# EAGLE schematic RGBLineSensor_Sensor (EAGLE 9.4.2)
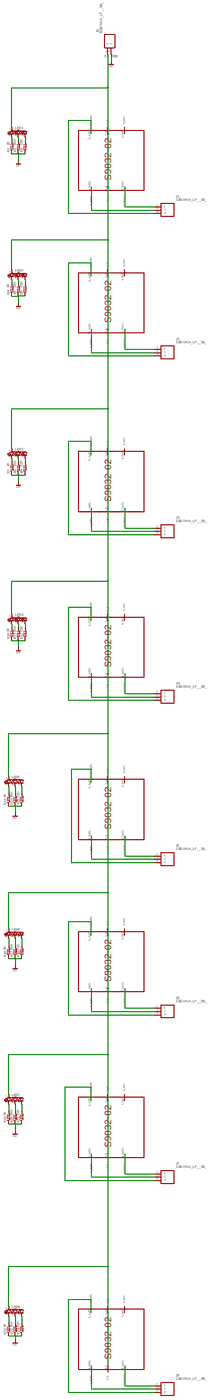
[diagram p0: schematic, sheet 1, overview]
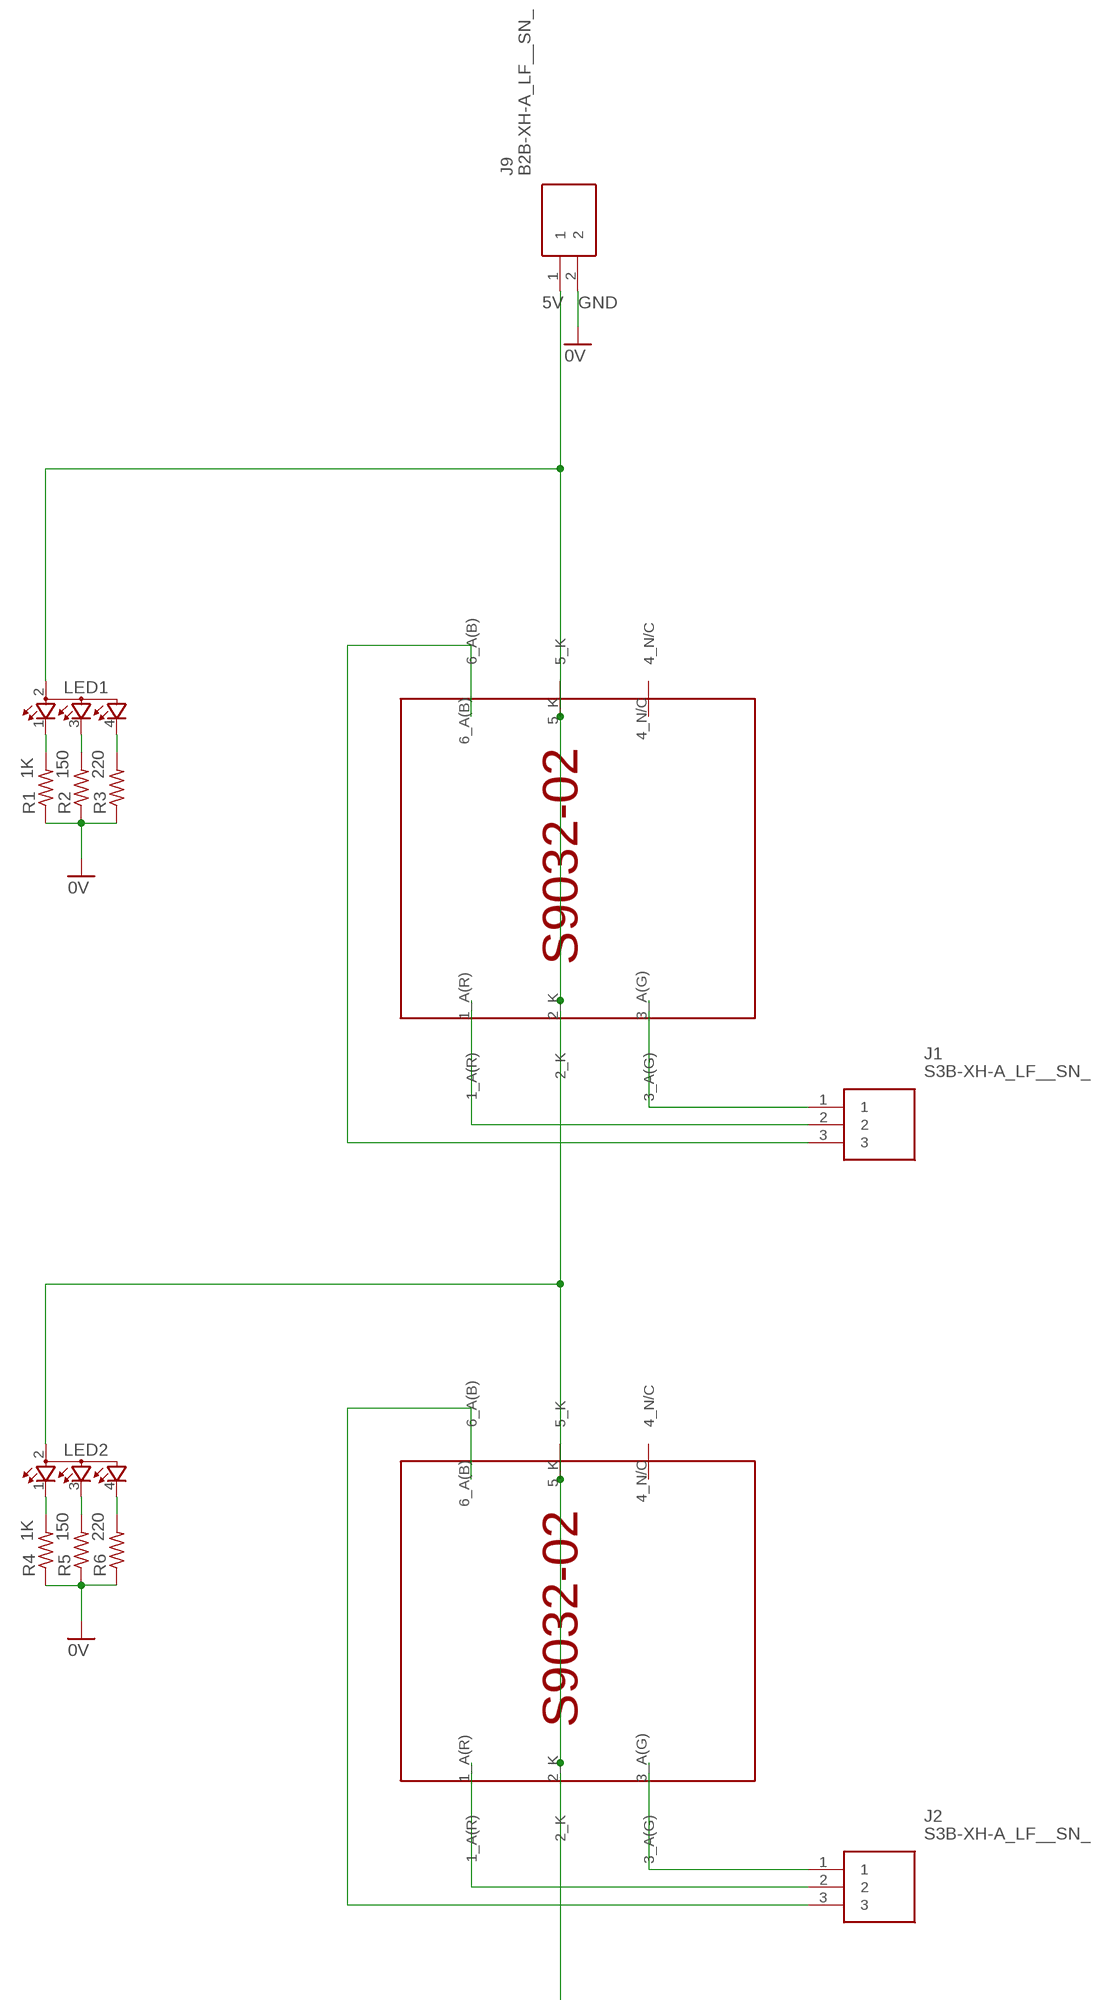
[diagram p1: schematic, sheet 1, part 1 of 4]
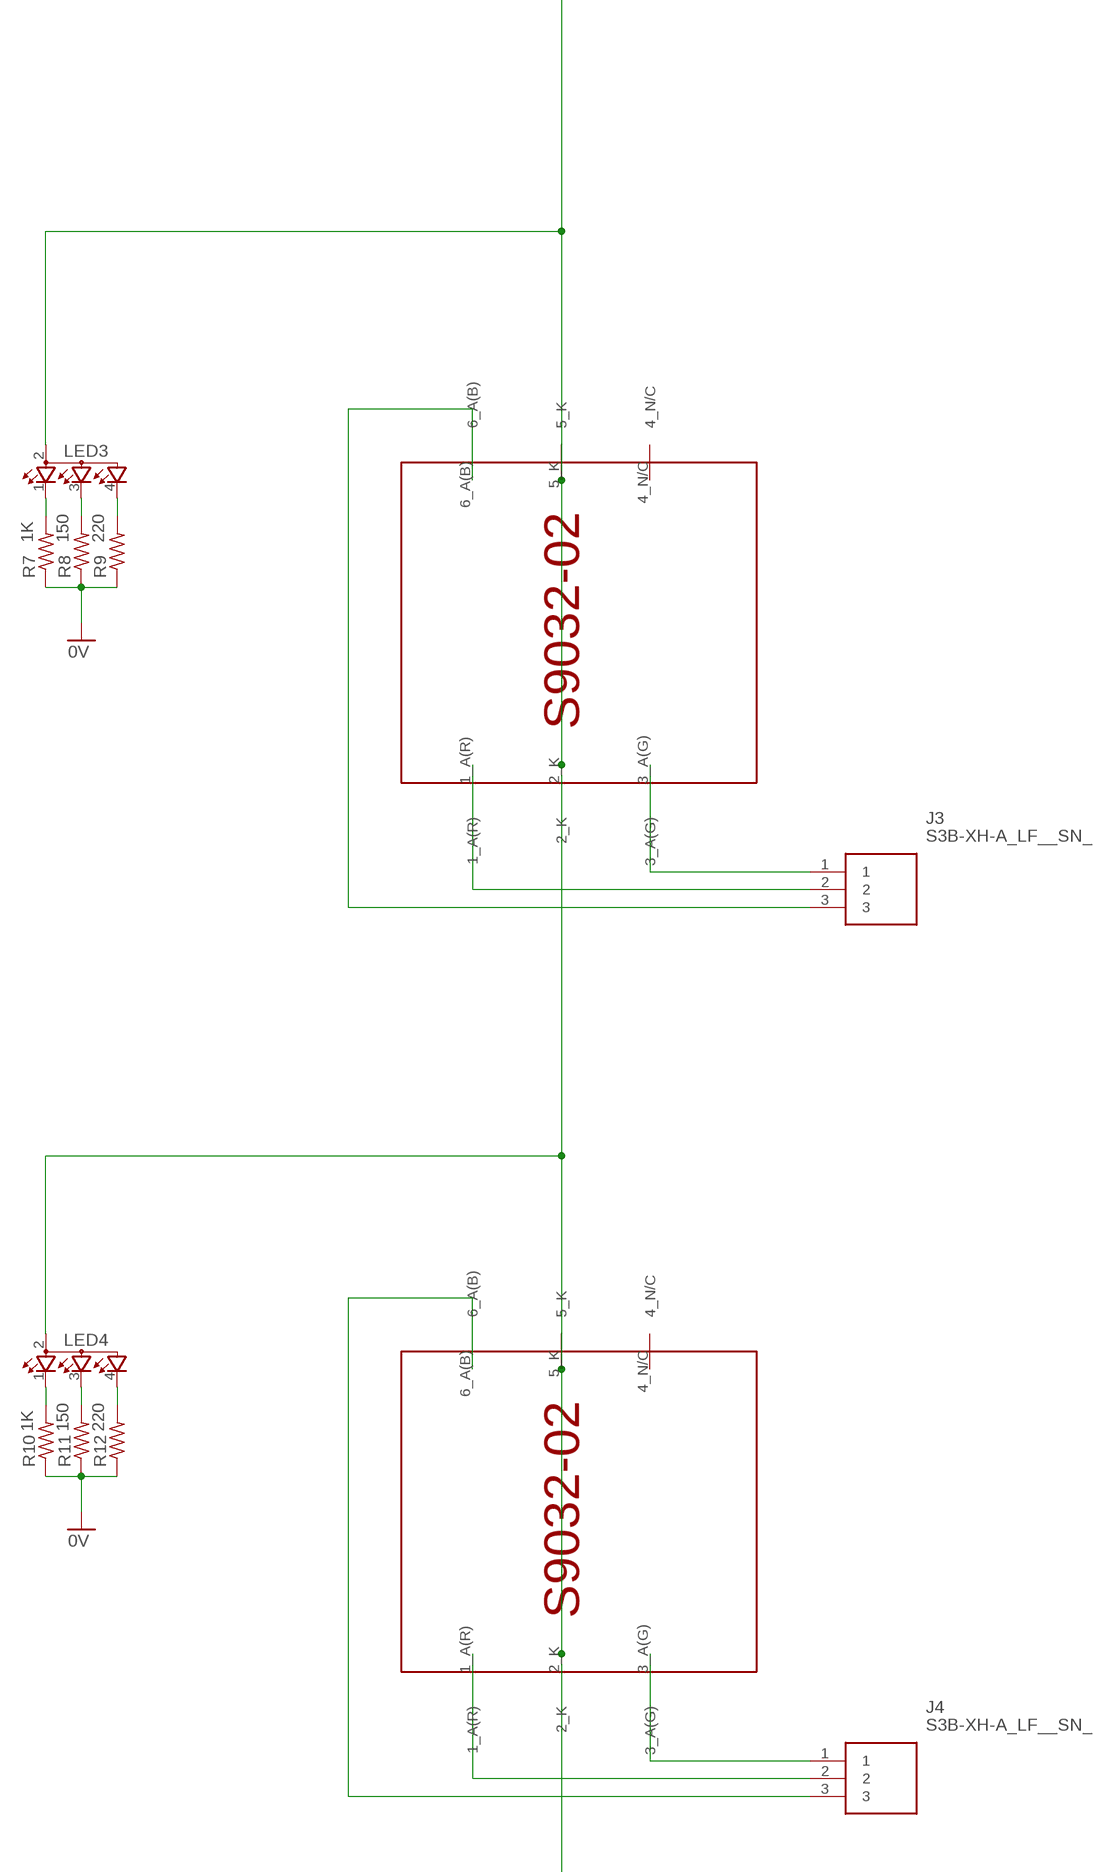
[diagram p2: schematic, sheet 1, part 2 of 4]
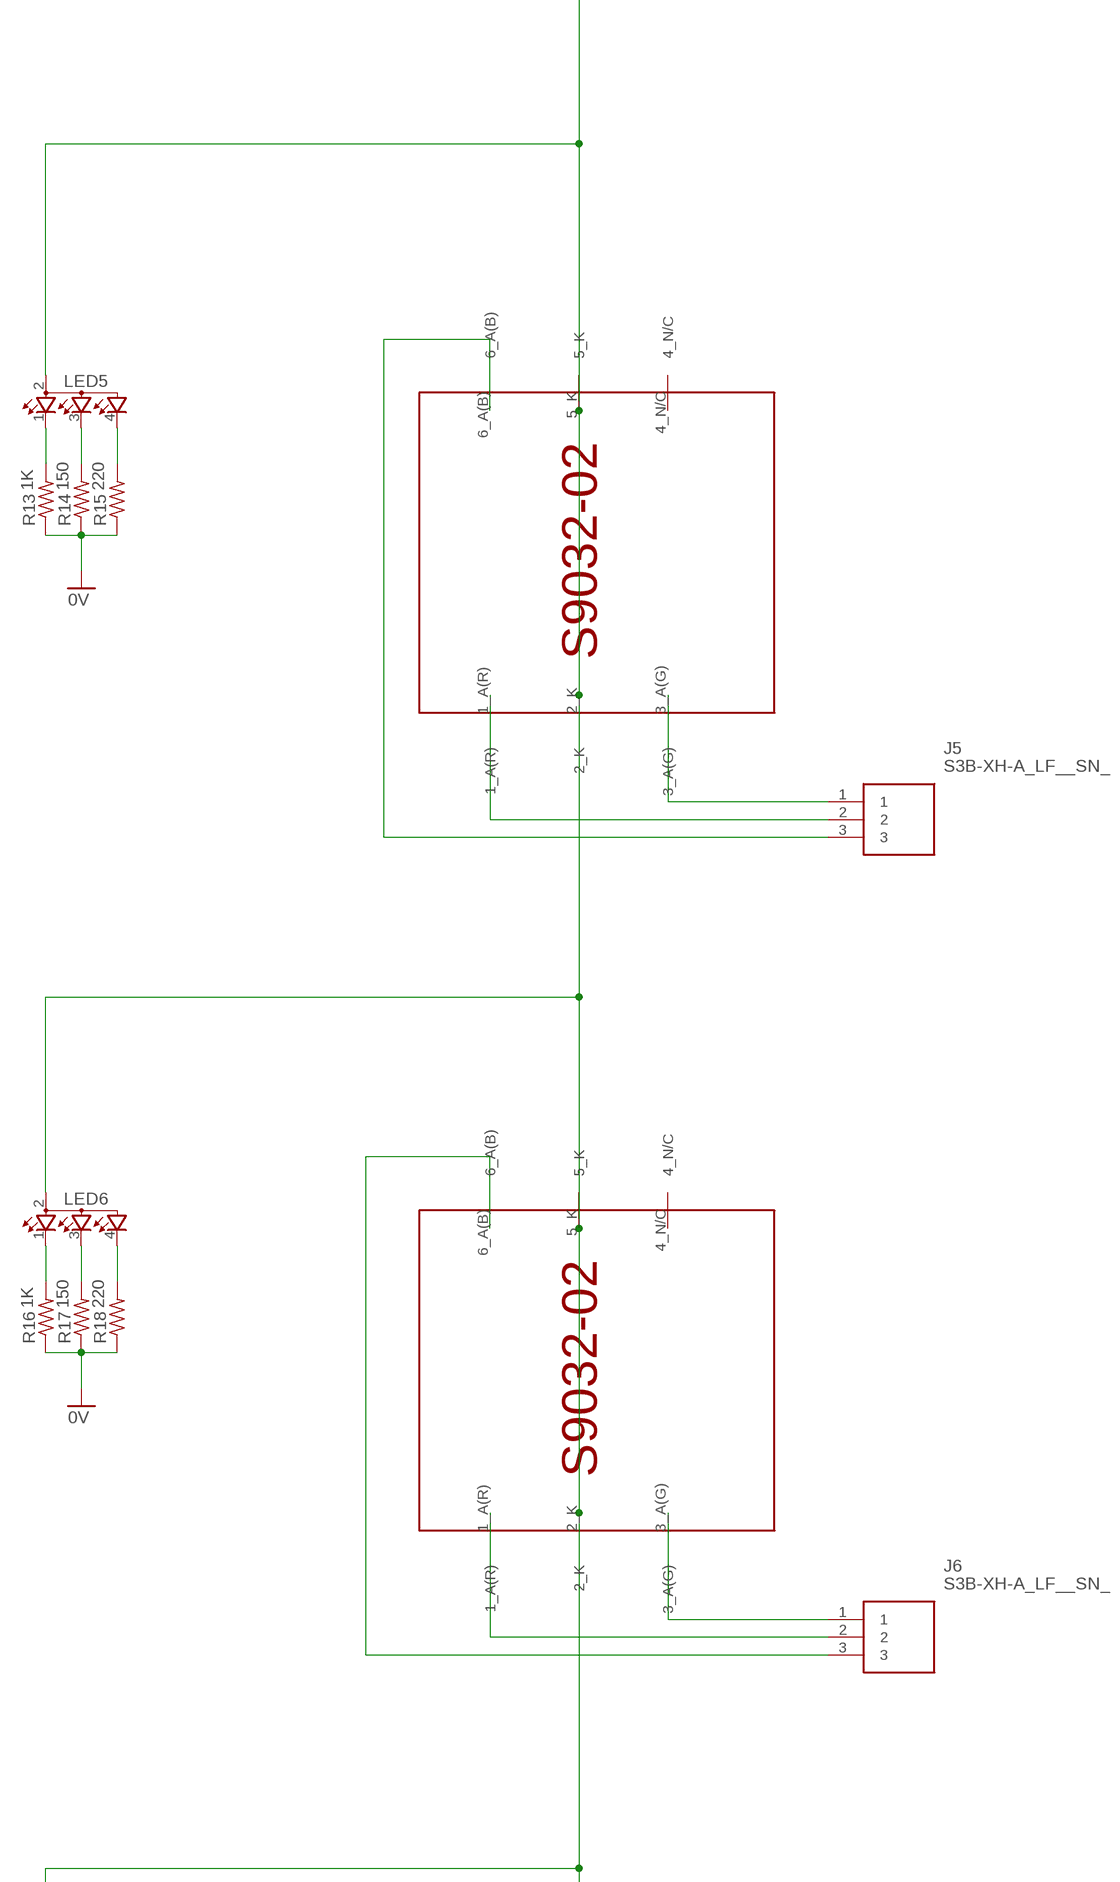
[diagram p3: schematic, sheet 1, part 3 of 4]
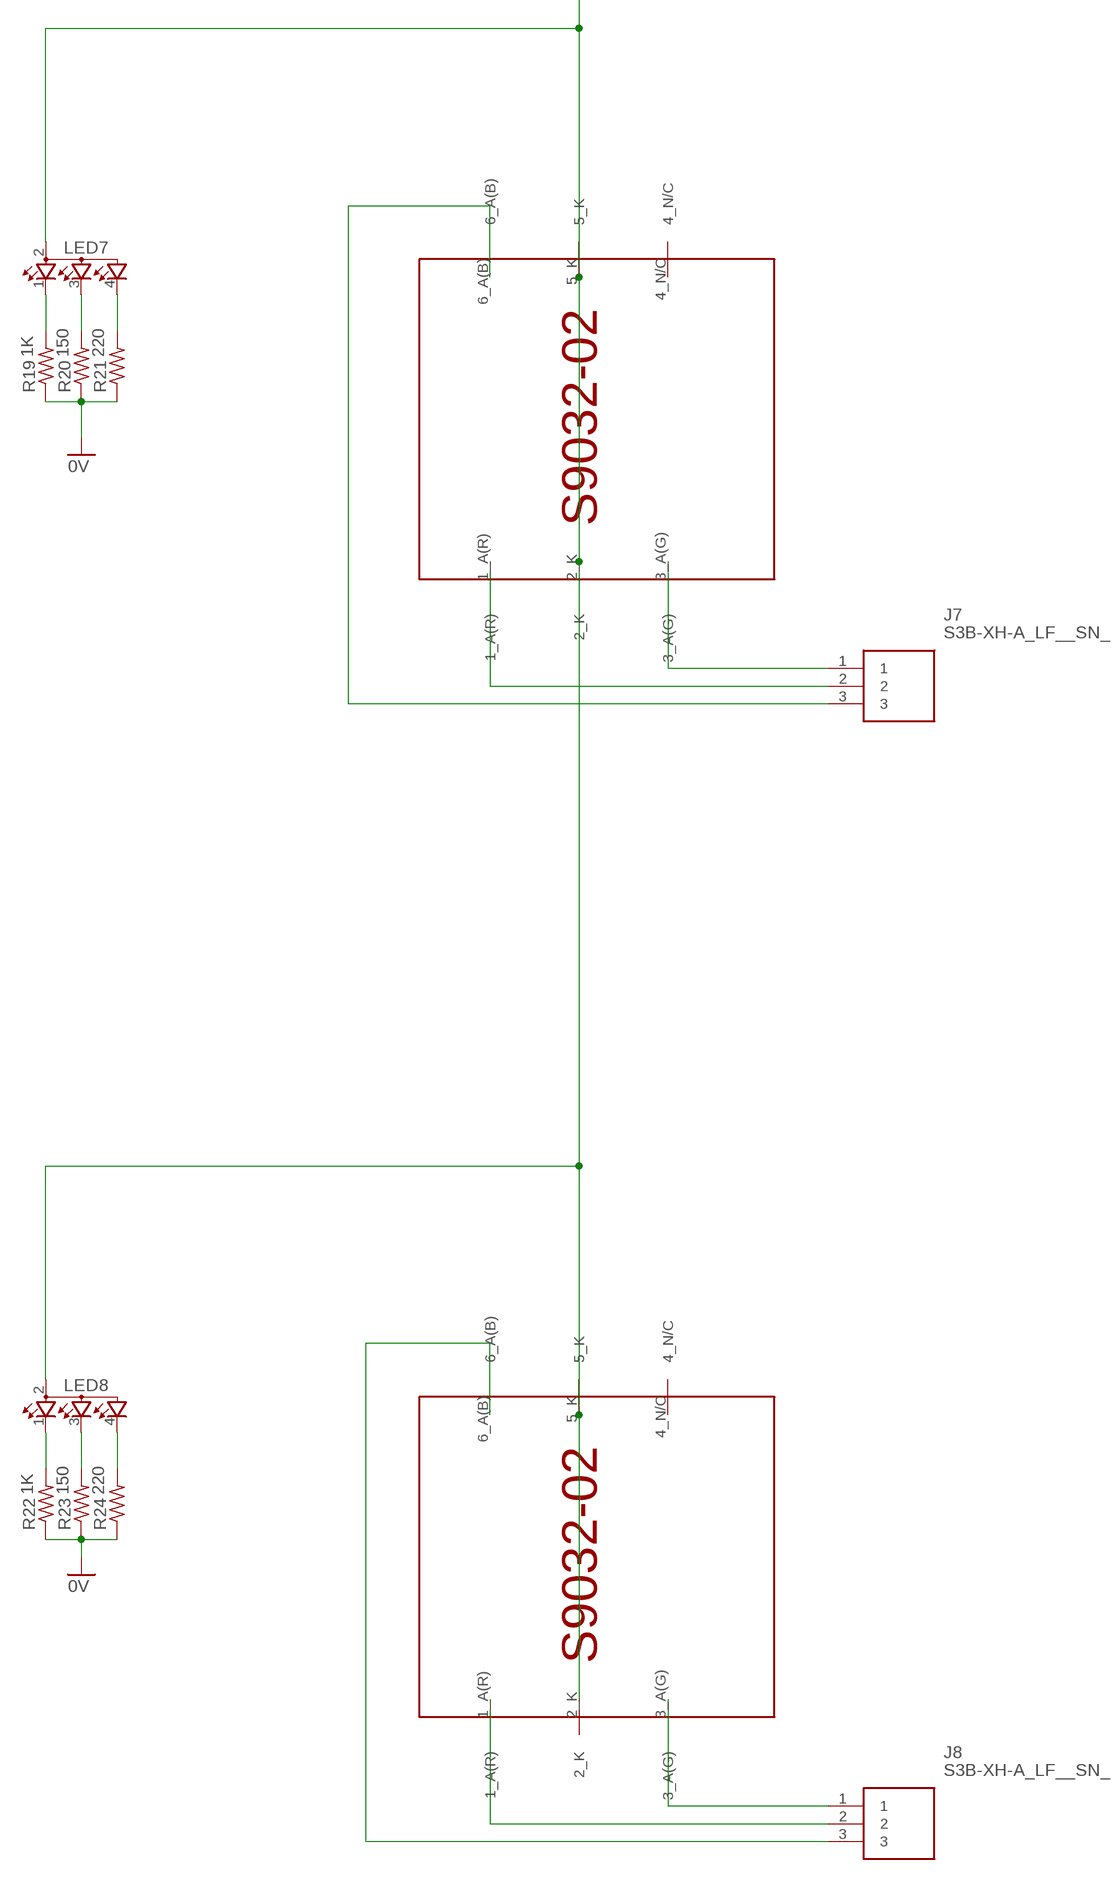
[diagram p4: schematic, sheet 1, part 4 of 4]

## Parts
J1  S3B-XH-A_LF__SN_  [SHDRRA3W80P0X250_1X3_990X1150X]
J2  S3B-XH-A_LF__SN_  [SHDRRA3W80P0X250_1X3_990X1150X]
J3  S3B-XH-A_LF__SN_  [SHDRRA3W80P0X250_1X3_990X1150X]
J4  S3B-XH-A_LF__SN_  [SHDRRA3W80P0X250_1X3_990X1150X]
J5  S3B-XH-A_LF__SN_  [SHDRRA3W80P0X250_1X3_990X1150X]
J6  S3B-XH-A_LF__SN_  [SHDRRA3W80P0X250_1X3_990X1150X]
J7  S3B-XH-A_LF__SN_  [SHDRRA3W80P0X250_1X3_990X1150X]
J8  S3B-XH-A_LF__SN_  [SHDRRA3W80P0X250_1X3_990X1150X]
J9  B2B-XH-A_LF__SN_  [SHDR2W64P0X250_1X2_740X575X700]
LED1  TOPLED-3  [P-LCC-4-3]
LED2  TOPLED-3  [P-LCC-4-3]
LED3  TOPLED-3  [P-LCC-4-3]
LED4  TOPLED-3  [P-LCC-4-3]
LED5  TOPLED-3  [P-LCC-4-3]
LED6  TOPLED-3  [P-LCC-4-3]
LED7  TOPLED-3  [P-LCC-4-3]
LED8  TOPLED-3  [P-LCC-4-3]
R1  1K  R-US_R0402  [R0402]
R2  150  R-US_R0402  [R0402]
R3  220  R-US_R0402  [R0402]
R4  1K  R-US_R0402  [R0402]
R5  150  R-US_R0402  [R0402]
R6  220  R-US_R0402  [R0402]
R7  1K  R-US_R0402  [R0402]
R8  150  R-US_R0402  [R0402]
R9  220  R-US_R0402  [R0402]
R10  1K  R-US_R0402  [R0402]
R11  150  R-US_R0402  [R0402]
R12  220  R-US_R0402  [R0402]
R13  1K  R-US_R0402  [R0402]
R14  150  R-US_R0402  [R0402]
R15  220  R-US_R0402  [R0402]
R16  1K  R-US_R0402  [R0402]
R17  150  R-US_R0402  [R0402]
R18  220  R-US_R0402  [R0402]
R19  1K  R-US_R0402  [R0402]
R20  150  R-US_R0402  [R0402]
R21  220  R-US_R0402  [R0402]
R22  1K  R-US_R0402  [R0402]
R23  150  R-US_R0402  [R0402]
R24  220  R-US_R0402  [R0402]
U$1  S9032-02  [S9032-02]
U$2  S9032-02  [S9032-02]
U$3  S9032-02  [S9032-02]
U$4  S9032-02  [S9032-02]
U$5  S9032-02  [S9032-02]
U$6  S9032-02  [S9032-02]
U$7  S9032-02  [S9032-02]
U$8  S9032-02  [S9032-02]

## Nets
0V: R1.1 R2.1 R3.1 R4.1 R5.1 R6.1 R7.1 R8.1 R9.1 R10.1 R11.1 R12.1 R13.1 R14.1 R15.1 R16.1 R17.1 R18.1 R19.1 R20.1 R21.1 R22.1 R23.1 R24.1
5V: J9.1 LED1.2(A2) LED2.2(A2) LED3.2(A2) LED4.2(A2) LED5.2(A2) LED6.2(A2) LED7.2(A2) LED8.2(A2) U$1.2_K U$1.5_K U$2.2_K U$2.5_K U$3.2_K U$3.5_K U$4.2_K U$4.5_K U$5.2_K U$5.5_K U$6.2_K U$6.5_K U$7.2_K U$7.5_K U$8.2_K U$8.5_K
GND: J9.2 ; supply symbol labelled 0V
N$1: LED2.1(CRED) R4.2
N$2: LED1.1(CRED) R1.2
N$3: LED1.3(CBLUE) R2.2
N$4: LED1.4(CGREEN) R3.2
N$5: LED2.3(CBLUE) R5.2
N$6: LED2.4(CGREEN) R6.2
N$9: LED3.1(CRED) R7.2
N$10: LED3.3(CBLUE) R8.2
N$11: LED3.4(CGREEN) R9.2
N$14: LED4.1(CRED) R10.2
N$15: LED4.3(CBLUE) R11.2
N$16: LED4.4(CGREEN) R12.2
N$18: LED5.1(CRED) R13.2
N$19: LED5.3(CBLUE) R14.2
N$20: LED5.4(CGREEN) R15.2
N$22: LED6.1(CRED) R16.2
N$23: LED6.3(CBLUE) R17.2
N$24: LED6.4(CGREEN) R18.2
N$27: LED7.1(CRED) R19.2
N$28: LED7.3(CBLUE) R20.2
N$29: LED7.4(CGREEN) R21.2
N$32: LED8.1(CRED) R22.2
N$33: LED8.3(CBLUE) R23.2
N$34: LED8.4(CGREEN) R24.2
N$36: J1.1 U$1.3_A(G)
N$37: J1.2 U$1.1_A(R)
N$38: J1.3 U$1.6_A(B)
N$39: J2.1 U$2.3_A(G)
N$40: J2.2 U$2.1_A(R)
N$41: J2.3 U$2.6_A(B)
N$42: J3.1 U$3.3_A(G)
N$43: J3.2 U$3.1_A(R)
N$44: J3.3 U$3.6_A(B)
N$45: J4.1 U$4.3_A(G)
N$46: J4.2 U$4.1_A(R)
N$47: J4.3 U$4.6_A(B)
N$48: J5.1 U$5.3_A(G)
N$49: J5.2 U$5.1_A(R)
N$50: J5.3 U$5.6_A(B)
N$51: J6.1 U$6.3_A(G)
N$52: J6.2 U$6.1_A(R)
N$53: J6.3 U$6.6_A(B)
N$54: J7.1 U$7.3_A(G)
N$55: J7.2 U$7.1_A(R)
N$56: J7.3 U$7.6_A(B)
N$57: J8.1 U$8.3_A(G)
N$58: J8.2 U$8.1_A(R)
N$59: J8.3 U$8.6_A(B)
Unconnected: U$1.4_N/C U$2.4_N/C U$3.4_N/C U$4.4_N/C U$5.4_N/C U$6.4_N/C U$7.4_N/C U$8.4_N/C

## Library data of the parts
J1-J8 = S3B-XH-A_LF__SN_:S3B-XH-A_LF__SN_: XH-2.5mm Header side entry 3 way JST XH Series, Series Number S3B, 2.5mm Pitch 3 Way 1 Row Right Angle PCB Header, Solder Termination, 3A Source: Datasheet <http://uk.rs-online.com/web/p/products/8201585P>; DESCRIPTION: XH-2.5mm Header side entry 3 way JST XH Series, Series Number S3B, 2.5mm Pitch 3 Way 1 Row Right Angle PCB Header, Solder Termination, 3A; HEIGHT: 6.1mm; MANUFACTURER_NAME: JST (JAPAN SOLDERLESS TERMINALS); MANUFACTURER_PART_NUMBER: S3B-XH-A(LF)(SN); RS_PART_NUMBER: 8201585P; RS_PRICE-STOCK: http://uk.rs-online.com/web/p/products/8201585P
J9 = B2B-XH-A_LF__SN_:B2B-XH-A_LF__SN_: JST XH Series, 2.5mm Pitch 2 Way 1 Row Straight PCB Header, Solder Termination, 3A Source: Datasheet <http://uk.rs-online.com/web/p/products/8201554P>; DESCRIPTION: JST XH Series, 2.5mm Pitch 2 Way 1 Row Straight PCB Header, Solder Termination, 3A; HEIGHT: 7mm; MANUFACTURER_NAME: JST (JAPAN SOLDERLESS TERMINALS); MANUFACTURER_PART_NUMBER: B2B-XH-A(LF)(SN); RS_PART_NUMBER: 8201554P; RS_PRICE-STOCK: http://uk.rs-online.com/web/p/products/8201554P
LED1-LED8 = led:TOPLED-3: OSRAM - Hyper Multi TOPLED® (RGB) LB E673, LV E673, LT E673 - Power TOPLED® Enhanced optical Power LED (HOP2000) LS E67B, LA E67B, LO E67B, LY E67B - Hyper Multi TOPLED® Enhanced optical Power LED (HOP2000 / ATON®) LATB T66B - Hyper Multi TOPLED® Hyper-Bright LED LATB T686 Source: http://www.osram.convergy.de/
R1-R24 = rcl:R-US_: RESISTOR, American symbol; SPICEPREFIX: R
U$1-U$8 = RGBcolorsensor:S9032-02